# EAGLE design base (EAGLE 9.6.2)
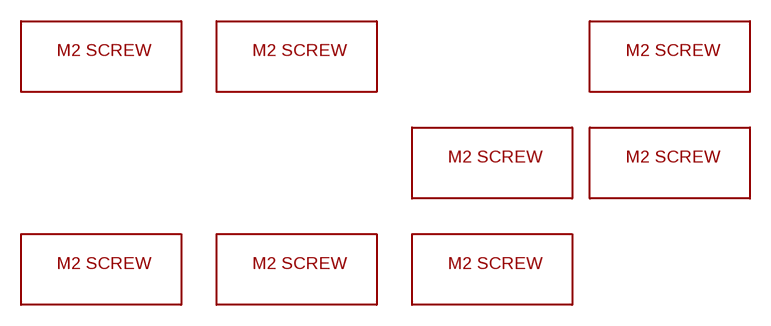
[diagram p0: schematic, sheet 1]

## Parts
U$8  M2_SCREW_DEV  [M2_SCREW_FOOT]
U$9  M2_SCREW_DEV  [M2_SCREW_FOOT]
U$10  M2_SCREW_DEV  [M2_SCREW_FOOT]
U$12  M2_SCREW_DEV  [M2_SCREW_FOOT]
U$13  M2_SCREW_DEV  [M2_SCREW_FOOT]
U$14  M2_SCREW_DEV  [M2_SCREW_FOOT]
U$17  M2_SCREW_DEV  [M2_SCREW_FOOT]
U$22  M2_SCREW_DEV  [M2_SCREW_FOOT]

## Library data of the parts
U$8-U$10 U$12-U$14 U$17 U$22 = duckypad:M2_SCREW_DEV

## Board
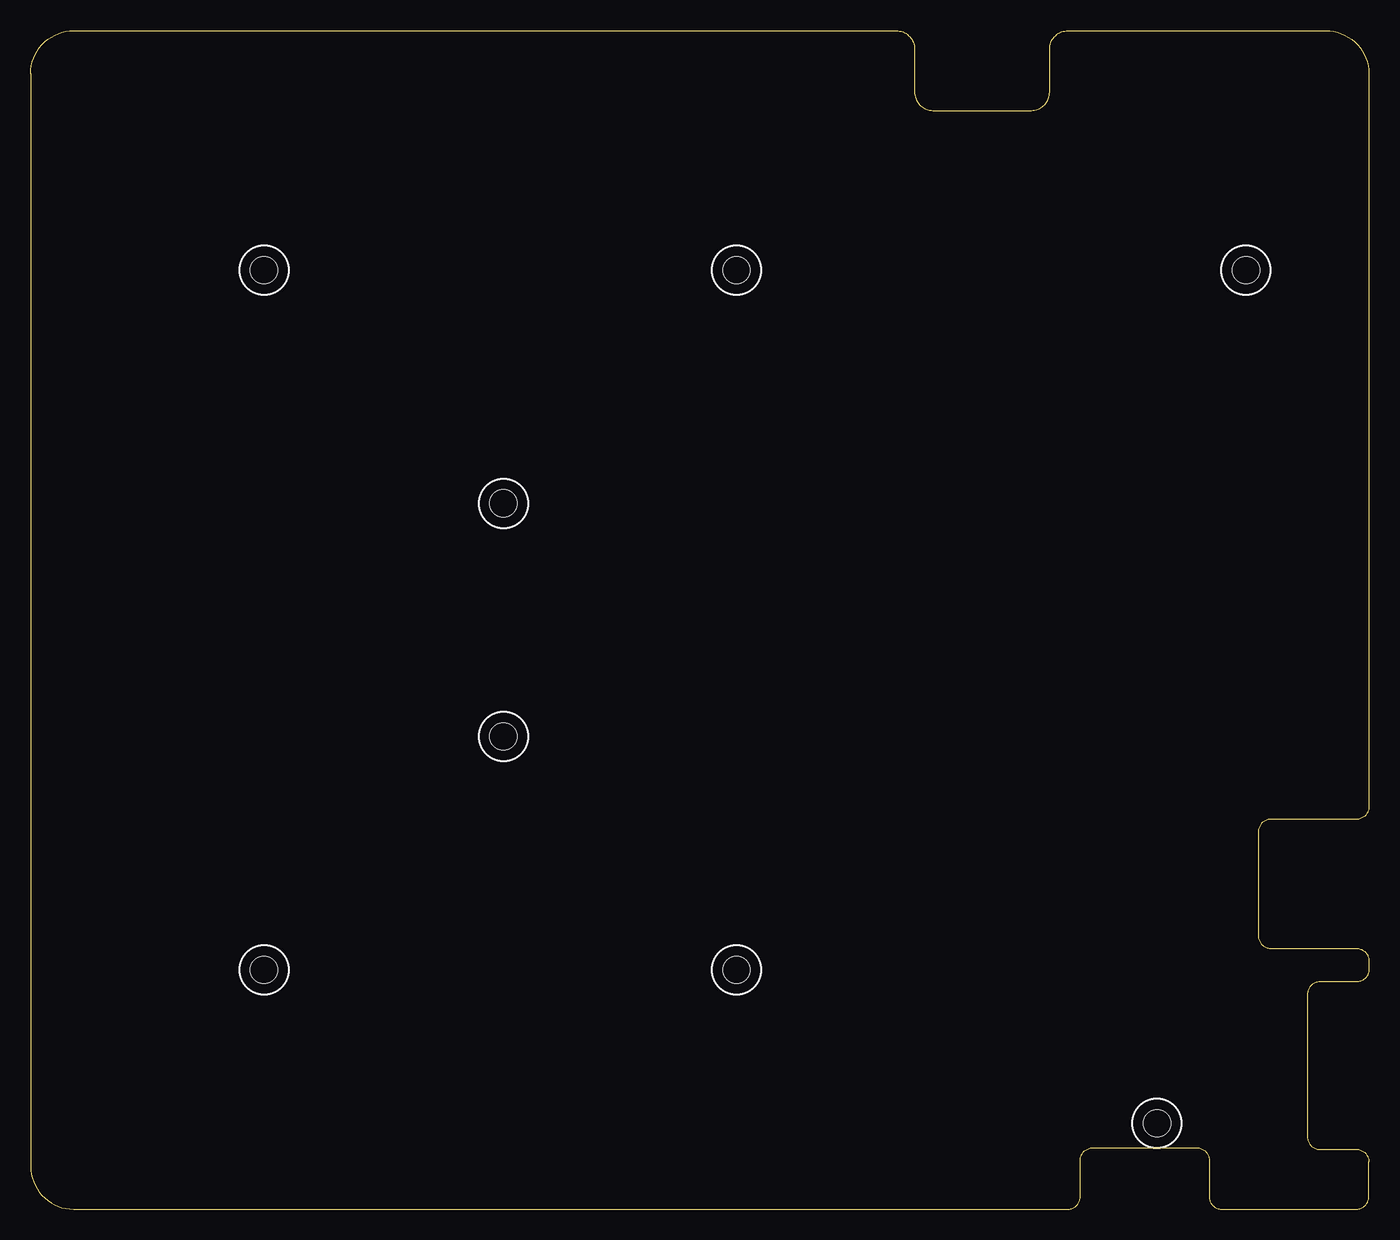
[diagram p1: board, top side]
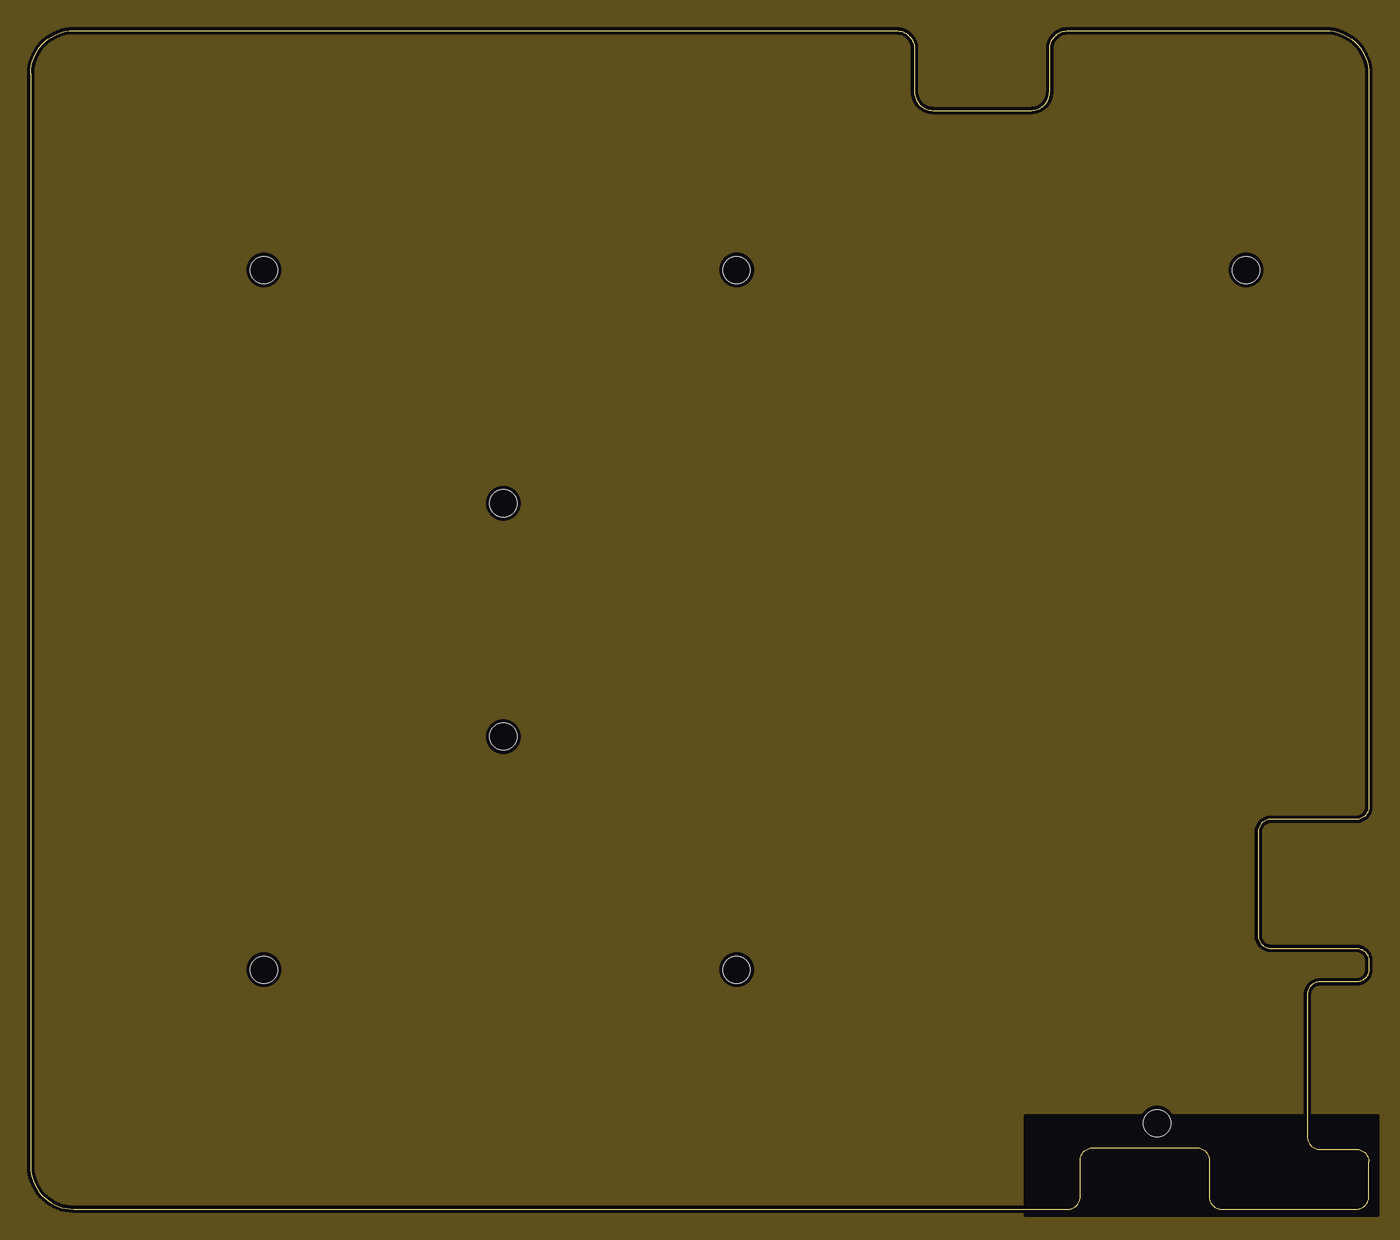
[diagram p2: board, inner layer pwr]
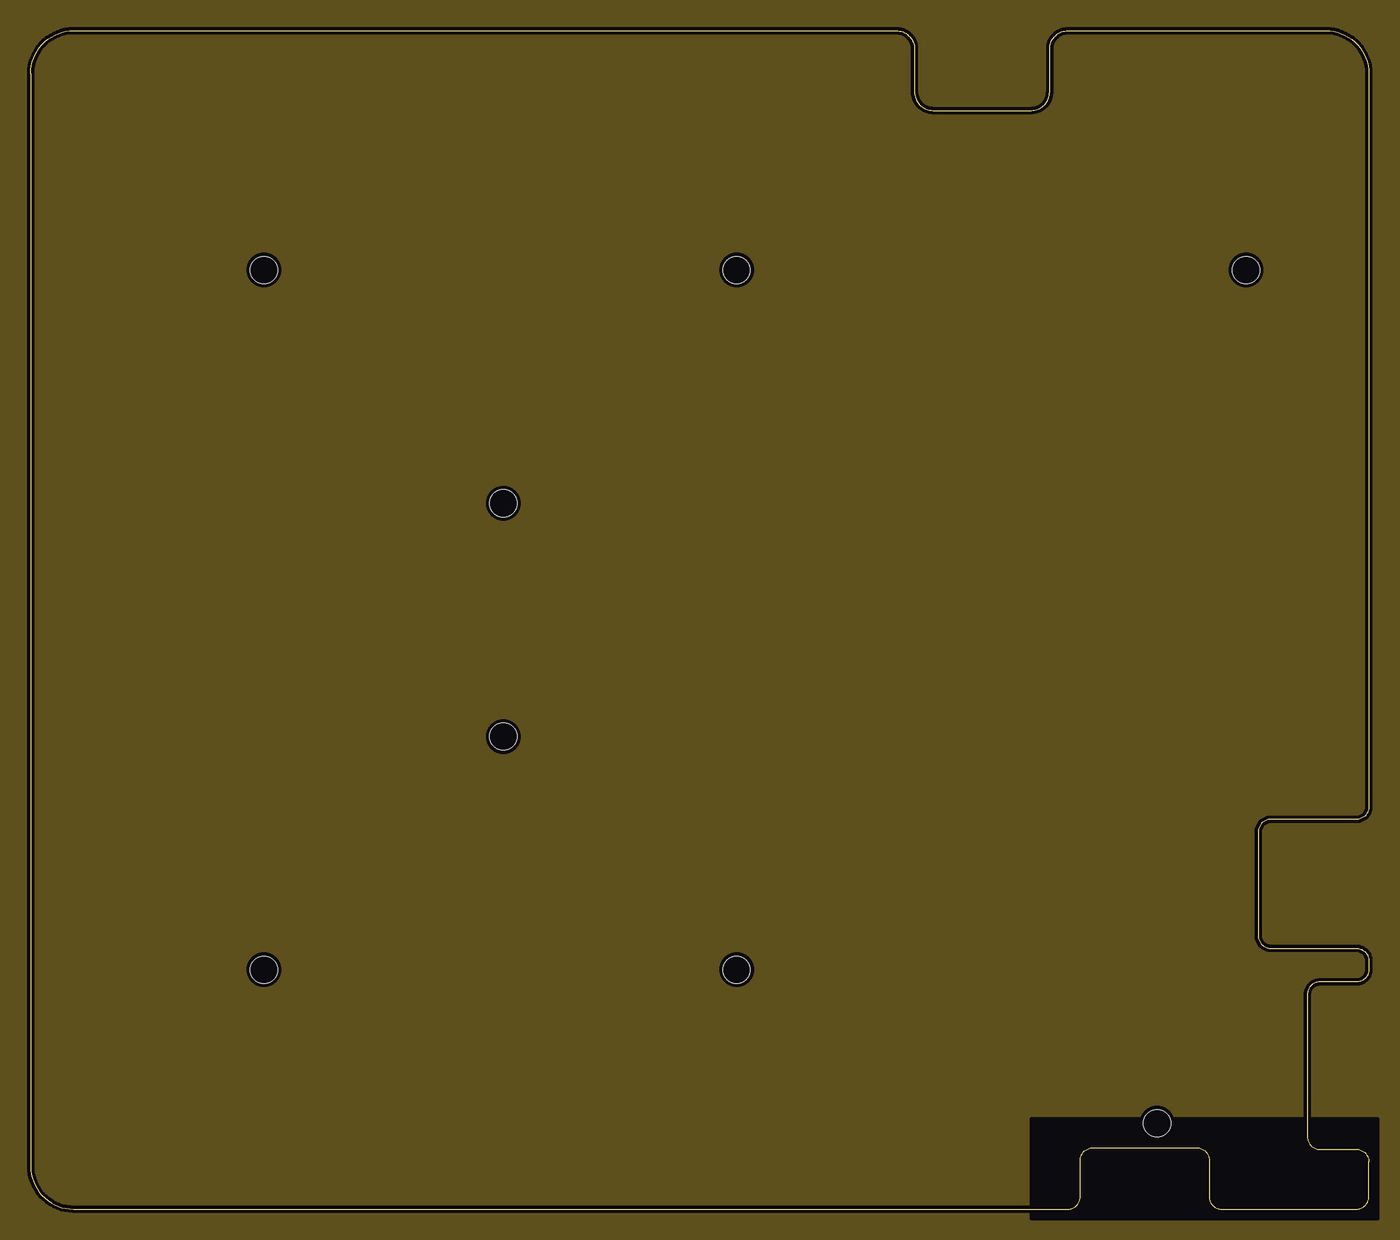
[diagram p3: board, inner layer gnd]
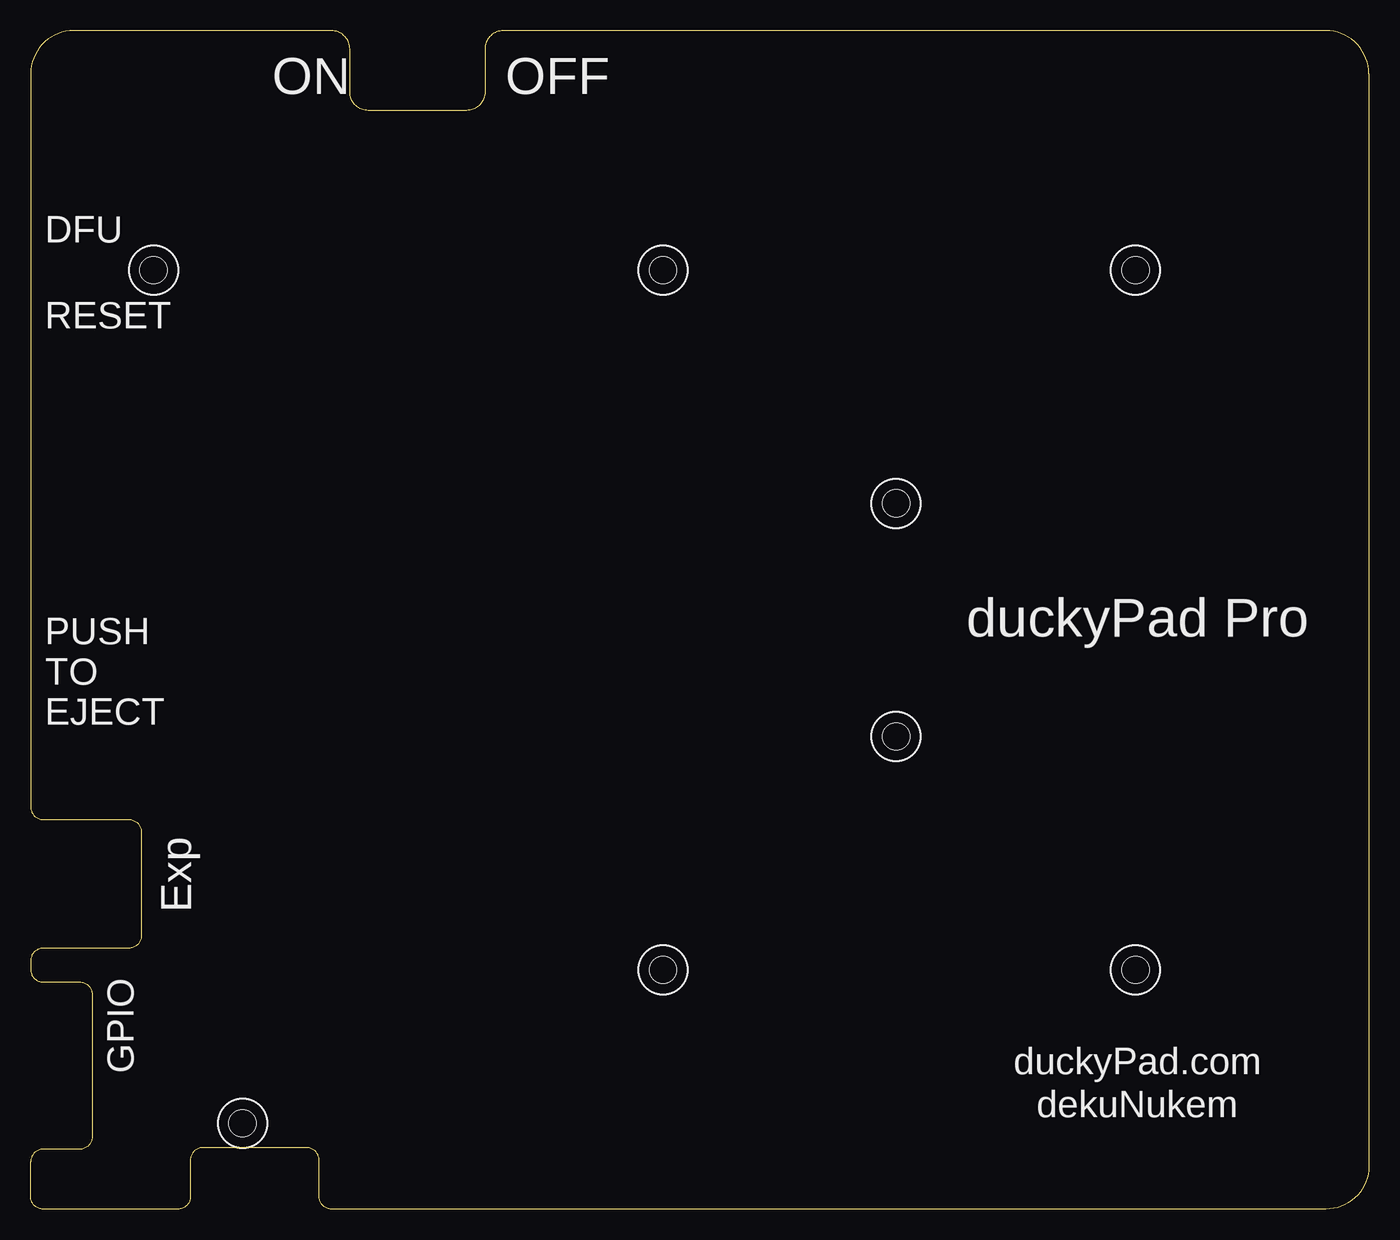
[diagram p4: board, bottom side, seen from below]

Size 109 x 96 mm. Coordinates in mm from the lower left corner, seen from the top.
Outline: 96,4 96,1 arc90 97,0 108,0 arc90 109,1 109,3.88 arc90 108,4.88 105,4.88 arc-90 104,5.88 104,17.5 arc-90 105,18.5 108,18.5 arc90 109,19.5 109,20.25 arc90 108,21.25 101,21.25 arc-90 100,22.25 100,30.75 arc-90 101,31.75 108,31.75 arc90 109,32.75 109,92.5 arc90 105.5,96 84.5,96 arc90 83,94.5 83,91 arc-90 81.5,89.5 73.5,89.5 arc-90 72,91 72,94.5 arc90 70.5,96 3.5,96 arc90 0,92.5 0,3.5 arc90 3.5,0 84.5,0 arc90 85.5,1 85.5,4 arc-90 86.5,5 95,5 arc-90 96,4
Copper layers (1+2*15+16): Top 0.035559375mm / dielectric 0.47751875mm / pwr 0.035559375mm / dielectric 0.47751875mm / gnd 0.035559375mm / dielectric 0.47751875mm / Bottom 0.035559375mm
Design rules "SparkFun-4-Layer-General-JLCPCB *": minimum track width 6mil, minimum drill 12mil, track to track 6mil, track to pad 6mil, pad to pad 6mil, via to via 6mil, smd to smd 6mil, copper to edge 6mil, drill to drill 6mil, minimum pad ring 7mil, minimum via ring 7mil, stop-mask expansion 3mil, vias tented up to drill 25mil, thermal gap 10mil

### Footprints (pad centres in the part's own frame; a part is rotated, then mirrored left to right if it is on the bottom)
M2_SCREW_FOOT = hole 2.2: 0,0

### Placement (x,y rotation side)
U$8  38.5,57.5 0 top
U$9  57.5,76.5 0 top
U$10  91.75,7 0 top
U$12  38.5,38.5 0 top
U$13  57.5,19.5 0 top
U$14  19,76.5 0 top
U$17  99,76.5 0 top
U$22  19,19.5 0 top

### Tracks (layer width: path | path; a pad name or v marks a point on that pad's centre or on a via)
+3V3
  pour pwr (isolate 0.305): -6.48,107.7 127.13,107.7 127.13,-13.08 -6.48,-13.08
GND
  pour gnd (isolate 0.305): -11.81,111.38 130.05,111.38 130.05,-16.89 -11.81,-16.89
WTF2
  cutout gnd: 81.53,7.37 109.73,7.37 109.73,-0.76 81.53,-0.76
  cutout pwr (no thermals): 81.03,7.62 109.73,7.62 109.73,-0.51 81.03,-0.51

### Text on the board
bNames: OFF | ON | DFU | RESET | duckyPad Pro | PUSH / TO / EJECT | Exp | GPIO | duckyPad.com / dekuNukem